# Altium project Krets_Brillz_V2.PrjPcb
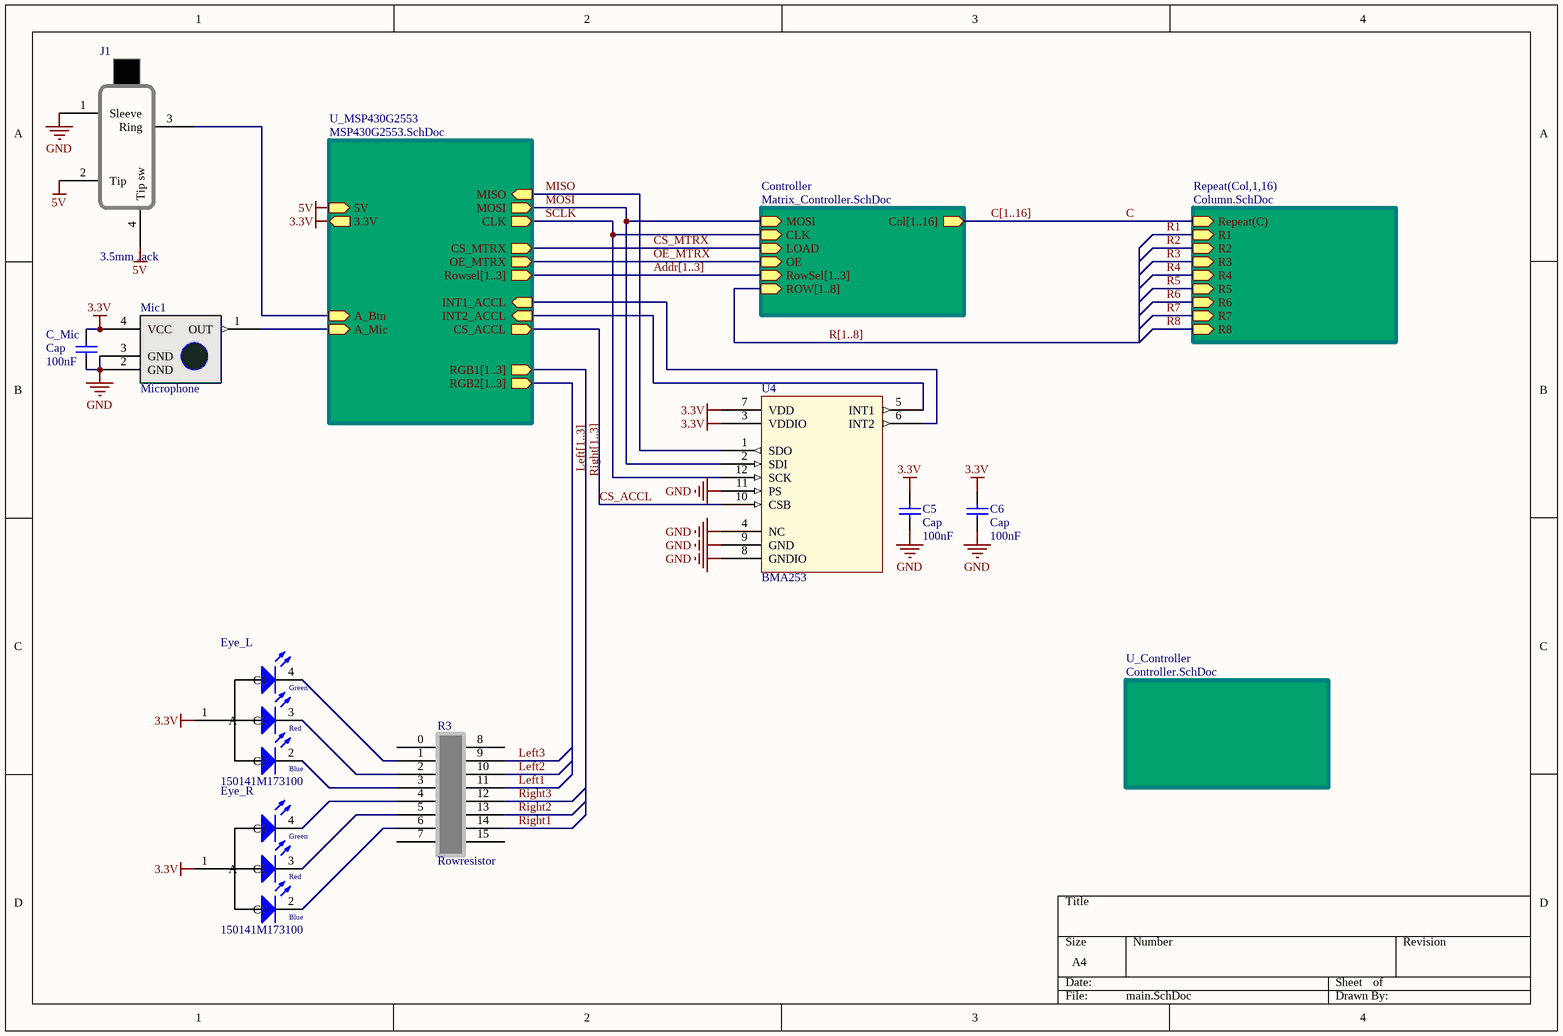
[diagram p0: main.SchDoc]
3 sheets, 145 parts. Net scope: hierarchical (ports join the sheet entries above them; power ports are global).
Board file: SchematicBKP.PcbDoc
Sheets:
  main.SchDoc
    Controller = Matrix_Controller.SchDoc
    Col1 = Column.SchDoc
    Col2 = Column.SchDoc
    Col3 = Column.SchDoc
    Col4 = Column.SchDoc
    Col5 = Column.SchDoc
    Col6 = Column.SchDoc
    Col7 = Column.SchDoc
    Col8 = Column.SchDoc
    Col9 = Column.SchDoc
    Col10 = Column.SchDoc
    Col11 = Column.SchDoc
    Col12 = Column.SchDoc
    Col13 = Column.SchDoc
    Col14 = Column.SchDoc
    Col15 = Column.SchDoc
    Col16 = Column.SchDoc

## Sheet main.SchDoc
size A4

### Parts
C5  Cap  value 100nF  [6-0805_M]
C6  Cap  value 100nF  [6-0805_M]
C_Mic  Cap  value 100nF  [6-0805_M]
Eye_L  150141M173100  [3528_A]
Eye_R  150141M173100  [3528_A]
J1  3.5mm Jack  [Phonejack]
Mic1  Microphone  [SPW2430HR5H-B]
R3  Rowresistor  [Rowres]
U4  BMA253  [BMA253]

### Sub-sheets
Controller = Matrix_Controller.SchDoc: OE (in), LOAD (in), CLK (in), MOSI (in), RowSel[1..3] (in), ROW[1..8] (in), Col[1..16] (out)
Repeat(Col,1,16) = Column.SchDoc: Repeat(C) (in), R1 (in), R2 (in), R3 (in), R4 (in), R5 (in), R6 (in), R7 (in), R8 (in)
U_Controller = Controller.SchDoc (file not in this document): no entries
U_MSP430G2553 = MSP430G2553.SchDoc (file not in this document): 5V (in), 3.3V (out), MOSI (out), MISO (in), CLK (out), CS_MTRX (out), RGB1[1..3] (out), RGB2[1..3] (out), CS_ACCL (out), A_Btn (in), A_Mic (in), Rowsel[1..3] (out), OE_MTRX (out), INT1_ACCL (in), INT2_ACCL (in)

### Nets
3.3V: C5.2 C6.2 C_Mic.1 Eye_L.1(A) Eye_R.1(A) Mic1.4(VCC) U4.3(VDDIO) U4.7(VDD) ; sheet U_MSP430G2553/3.3V
5V: J1.2(Tip) J1.4(Tip_sw) ; sheet U_MSP430G2553/5V
GND: C5.1 C6.1 C_Mic.2 J1.1(Sleeve) Mic1.2(GND) Mic1.3(GND) U4.4(NC) U4.8(GNDIO) U4.9(GND) U4.11(PS)
C: sheet Repeat(Col,1,16)/Repeat(C)
CS_ACCL: U4.10(CSB) ; sheet U_MSP430G2553/CS_ACCL
CS_MTRX: sheet Controller/LOAD, sheet U_MSP430G2553/CS_MTRX
Left1: R3.11
Left2: R3.10
Left3: R3.9
MISO: U4.1(SDO) ; sheet U_MSP430G2553/MISO
MOSI: U4.2(SDI) ; sheet Controller/MOSI, sheet U_MSP430G2553/MOSI
OE_MTRX: sheet Controller/OE, sheet U_MSP430G2553/OE_MTRX
Right1: R3.14
Right2: R3.13
Right3: R3.12
SCLK: U4.12(SCK) ; sheet Controller/CLK, sheet U_MSP430G2553/CLK  [project net CLK]
NetEye_L_2: Eye_L.2(C3) R3.3
NetEye_L_3: Eye_L.3(C2) R3.2
NetEye_L_4: Eye_L.4(C1) R3.1
NetEye_R_2: Eye_R.2(C3) R3.6
NetEye_R_3: Eye_R.3(C2) R3.5
NetEye_R_4: Eye_R.4(C1) R3.4
NetJ1_3: J1.3(Ring) ; sheet U_MSP430G2553/A_Btn
NetMic1_1: Mic1.1(OUT) ; sheet U_MSP430G2553/A_Mic
NetU4_5: U4.5(INT1) ; sheet U_MSP430G2553/INT2_ACCL
NetU4_6: U4.6(INT2) ; sheet U_MSP430G2553/INT1_ACCL

Not connected (* = marked no-connect by the designer): R3 0 7 8 15

### Buses and harness runs
bus Addr[1..3] = sheet Controller/RowSel[1..3] = sheet U_MSP430G2553/Rowsel[1..3]
bus C[1..16] = sheet Controller/Col[1..16]
bus Left[1..3] = sheet U_MSP430G2553/RGB2[1..3]
bus R[1..8] = sheet Controller/ROW[1..8]
bus Right[1..3] = sheet U_MSP430G2553/RGB1[1..3]

### Notes on the sheet
- (in symbol 150141M173100) Green; Red; Blue

### Library data of the parts
C5 C6 C_Mic = Cap: Capacitor; Published: 8-Jun-2000; LatestRevisionDate: 17-Jul-2002; LatestRevisionNote: Re-released for DXP Platform.; PackageReference: RAD-0.3; Publisher: Altium Limited; PackageDescription: Radial Cap, Thru-Hole; 2 Leads; 0.3 in Pin Spacing
Eye_L Eye_R = 150141M173100: SMD Full-Color Top LED, WL-SFTW, Red & Green & Blue; PackageReference: 3528_A; Color: Red & Green & Blue; PartNumber: 150141M173100; ComponentLink1Description: Manufacturer URL; ComponentLink1URL: http://www.we-online.com; ComponentLink2Description: Datasheet; ComponentLink2URL: http://katalog.we-online.com/led/datasheet/150141M173100.pdf
J1 = Phonejack
Mic1 = MIC: SPW2430HR5H-B  MEMs Microphone
R3 = Rowres: Row resistor, 8
U4 = ACCELEROMETER

## Sheet Matrix_Controller.SchDoc
size A4; DocumentName: Matrix controller
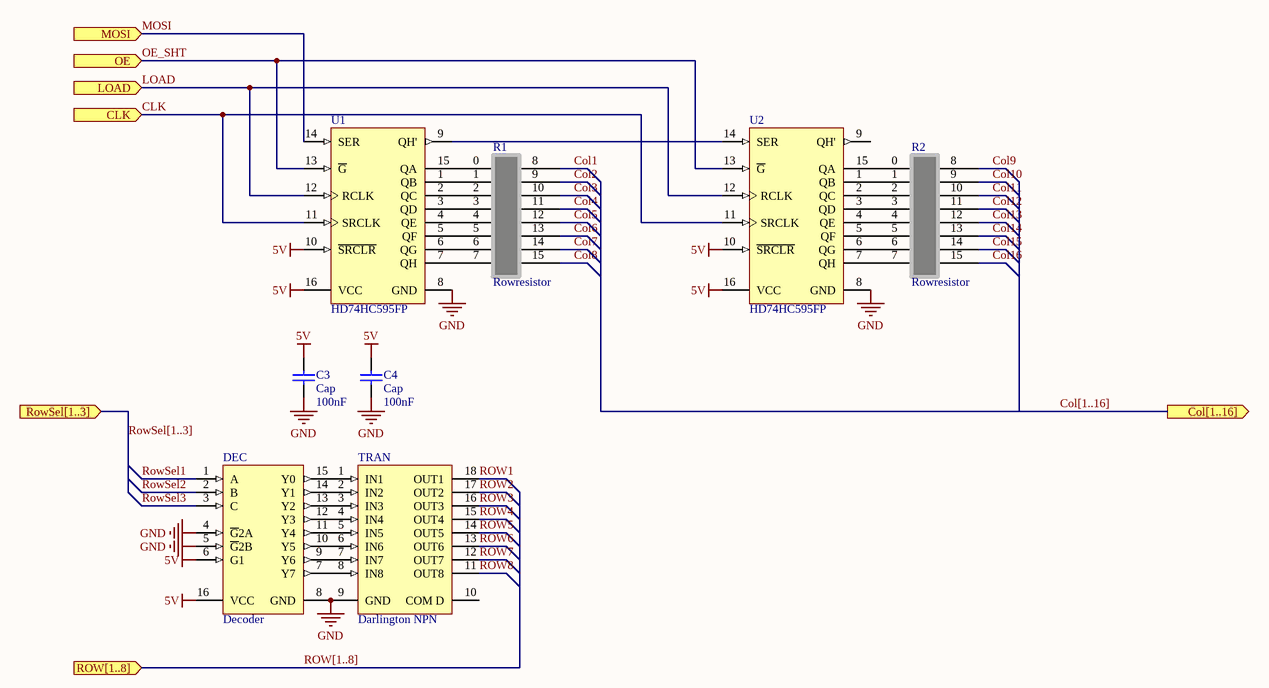
[diagram p1: Matrix_Controller.SchDoc]

### Parts
C3  Cap  value 100nF  [6-0805_M]
C4  Cap  value 100nF  [6-0805_M]
DEC  Decoder  [PRSP0016DH-B_N]
R1  Rowresistor  [Rowres]
R2  Rowresistor  [Rowres]
TRAN  Darlington NPN  [LW18_N]
U1  HD74HC595FP  [PRSP0016DH-B_N]
U2  HD74HC595FP  [PRSP0016DH-B_N]

### Ports
CLK (in), Col[1..16] (out), LOAD (in), MOSI (in), OE (in), ROW[1..8] (in), RowSel[1..3] (in)

### Nets
5V: C3.1 C4.1 DEC.6(G1) DEC.16(VCC) U1.10(~{SRCLR}) U1.16(VCC) U2.10(~{SRCLR}) U2.16(VCC)
GND: C3.2 C4.2 DEC.4(~{G}2A) DEC.5(~{G}2B) DEC.8(GND) TRAN.9(GND) U1.8(GND) U2.8(GND)
CLK: U1.11(SRCLK) U2.11(SRCLK) ; port CLK
Col1: R1.8  [project net C]
Col2: R1.9  [project net C]
Col3: R1.10  [project net C]
Col4: R1.11  [project net C]
Col5: R1.12  [project net C]
Col6: R1.13  [project net C]
Col7: R1.14  [project net C]
Col8: R1.15  [project net C]
Col9: R2.8  [project net C]
Col10: R2.9  [project net C]
Col11: R2.10  [project net C]
Col12: R2.11  [project net C]
Col13: R2.12  [project net C]
Col14: R2.13  [project net C]
Col15: R2.14  [project net C]
Col16: R2.15  [project net C]
LOAD: U1.12(RCLK) U2.12(RCLK) ; port LOAD  [project net CS_MTRX]
MOSI: U1.14(SER) ; port MOSI
OE_SHT: U1.13(~{G}) U2.13(~{G}) ; port OE  [project net OE_MTRX]
ROW1: TRAN.18(OUT1)  [project net R1]
ROW2: TRAN.17(OUT2)  [project net R2]
ROW3: TRAN.16(OUT3)  [project net R3]
ROW4: TRAN.15(OUT4)  [project net R4]
ROW5: TRAN.14(OUT5)  [project net R5]
ROW6: TRAN.13(OUT6)  [project net R6]
ROW7: TRAN.12(OUT7)  [project net R7]
ROW8: TRAN.11(OUT8)  [project net R8]
RowSel1: DEC.1(A)  [project net Addr1]
RowSel2: DEC.2(B)  [project net Addr2]
RowSel3: DEC.3(C)  [project net Addr3]
NetDEC_7: DEC.7(Y7) TRAN.8(IN8)
NetDEC_9: DEC.9(Y6) TRAN.7(IN7)
NetDEC_10: DEC.10(Y5) TRAN.6(IN6)
NetDEC_11: DEC.11(Y4) TRAN.5(IN5)
NetDEC_12: DEC.12(Y3) TRAN.4(IN4)
NetDEC_13: DEC.13(Y2) TRAN.3(IN3)
NetDEC_14: DEC.14(Y1) TRAN.2(IN2)
NetDEC_15: DEC.15(Y0) TRAN.1(IN1)
NetR1_0: R1.0 U1.15(QA)
NetR1_1: R1.1 U1.1(QB)
NetR1_2: R1.2 U1.2(QC)
NetR1_3: R1.3 U1.3(QD)
NetR1_4: R1.4 U1.4(QE)
NetR1_5: R1.5 U1.5(QF)
NetR1_6: R1.6 U1.6(QG)
NetR1_7: R1.7 U1.7(QH)
NetR2_0: R2.0 U2.15(QA)
NetR2_1: R2.1 U2.1(QB)
NetR2_2: R2.2 U2.2(QC)
NetR2_3: R2.3 U2.3(QD)
NetR2_4: R2.4 U2.4(QE)
NetR2_5: R2.5 U2.5(QF)
NetR2_6: R2.6 U2.6(QG)
NetR2_7: R2.7 U2.7(QH)
NetU1_9: U1.9(QH') U2.14(SER)

Not connected (* = marked no-connect by the designer): TRAN 10(COM_D); U2 9(QH')

### Buses and harness runs
bus Col[1..16] = port Col[1..16]
bus ROW[1..8] = port ROW[1..8]
bus RowSel[1..3] = port RowSel[1..3]

### Library data of the parts
C3 C4 = Cap: Capacitor; Published: 8-Jun-2000; LatestRevisionDate: 17-Jul-2002; LatestRevisionNote: Re-released for DXP Platform.; PackageReference: RAD-0.3; Publisher: Altium Limited; PackageDescription: Radial Cap, Thru-Hole; 2 Leads; 0.3 in Pin Spacing
DEC = HD74HC238FP: 3-to-8 Line Decoder / Demultiplexer; Published: 10-Feb-2010; DatasheetVersion: Rev.2.00, Jan-2006; PackageVersion: Sep-2005; PackageReference: PRSP0016DH-B; Publisher: Altium Limited; PackageDescription: 16-Pin Plastic Small Outline Package 1.27 mm Pitch; Code_JEITA: P-SOP16-5.5x10.06-1.27; ComponentLink1Description: Manufacturer Link; ComponentLink1URL: http://sg.renesas.com/fmwk.jsp?cnt=hd74hc_root.jsp&fp=/products/standard_ic/general_purpose_logic/5v_standard_logic/hd74hc/; ComponentLink2Description: Datasheet; ComponentLink2URL: http://documentation.renesas.com/eng/products/logic/rej03d0593_hd74hc238ds.pdf; ComponentLink3Description: Packaging Specification; ComponentLink3URL: http://sg.renesas.com/media/products/common_info/package/pdf/ic/code/prsp0016dh_b.pdf
R1 R2 = Rowres: Row resistor, 8
TRAN = ULN2803LW: High-Voltage, High-Current Darlington Array; Published: 13-Oct-2000; LatestRevisionDate: 13-Apr-2006; LatestRevisionNote: IPC-7351 Footprint Added.; DatasheetVersion: 1999; PackageReference: LW18; Publisher: Altium Limited; PackageDescription: 18-Pin Small Outline Integrated Circuit 1.27 mm Pitch; Code_JEDEC: MS-013-AB; ComponentLink1Description: Manufacturer Link; ComponentLink1URL: http://www.allegromicro.com/
U1 U2 = HD74HC595FP: 8-bit Shift Register / Latch with 3-State Outputs; Published: 10-Feb-2010; DatasheetVersion: Rev.2.00, Mar-2006; PackageVersion: Sep-2005; PackageReference: PRSP0016DH-B; Publisher: Altium Limited; PackageDescription: 16-Pin Plastic Small Outline Package 1.27 mm Pitch; Code_JEITA: P-SOP16-5.5x10.06-1.27; ComponentLink1Description: Manufacturer Link; ComponentLink1URL: http://sg.renesas.com/fmwk.jsp?cnt=hd74hc_root.jsp&fp=/products/standard_ic/general_purpose_logic/5v_standard_logic/hd74hc/; ComponentLink2Description: Datasheet; ComponentLink2URL: http://documentation.renesas.com/eng/products/logic/rej03d0634_hd74hc595ds.pdf; ComponentLink3Description: Packaging Specification; ComponentLink3URL: http://sg.renesas.com/media/products/common_info/package/pdf/ic/code/prsp0016dh_b.pdf

## Sheet Column.SchDoc
size A4
Used 16 times, as channels Col1, Col2, Col3, Col4, Col5, Col6, Col7, Col8, Col9, Col10, Col11, Col12, Col13, Col14, Col15, Col16. Parts and nets are listed once, with the designators drawn on the sheet.
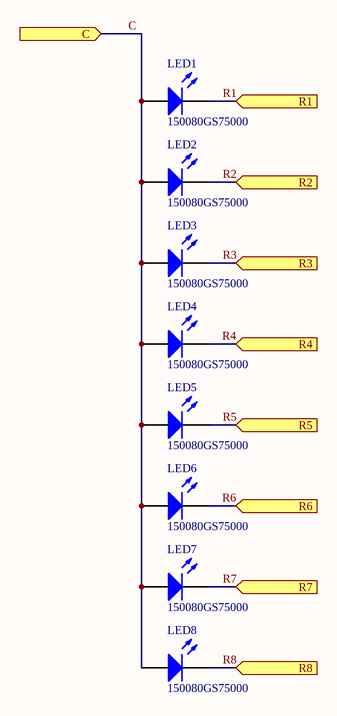
[diagram p2: Column.SchDoc]

### Parts
LED1  150080GS75000  [0805_A]
LED2  150080GS75000  [0805_A]
LED3  150080GS75000  [0805_A]
LED4  150080GS75000  [0805_A]
LED5  150080GS75000  [0805_A]
LED6  150080GS75000  [0805_A]
LED7  150080GS75000  [0805_A]
LED8  150080GS75000  [0805_A]

### Ports
C (in), R1 (in), R2 (in), R3 (in), R4 (in), R5 (in), R6 (in), R7 (in), R8 (in)

### Nets
C: LED1.2(A) LED2.2(A) LED3.2(A) LED4.2(A) LED5.2(A) LED6.2(A) LED7.2(A) LED8.2(A) ; port C
R1: LED1.1(K) ; port R1
R2: LED2.1(K) ; port R2
R3: LED3.1(K) ; port R3
R4: LED4.1(K) ; port R4
R5: LED5.1(K) ; port R5
R6: LED6.1(K) ; port R6
R7: LED7.1(K) ; port R7
R8: LED8.1(K) ; port R8

### Channels
Col1: designators end in _Col1; ports C=C R1=R1 R2=R2 R3=R3 R4=R4 R5=R5 R6=R6 R7=R7 R8=R8
Col2: designators end in _Col2; ports C=C R1=R1 R2=R2 R3=R3 R4=R4 R5=R5 R6=R6 R7=R7 R8=R8
Col3: designators end in _Col3; ports C=C R1=R1 R2=R2 R3=R3 R4=R4 R5=R5 R6=R6 R7=R7 R8=R8
Col4: designators end in _Col4; ports C=C R1=R1 R2=R2 R3=R3 R4=R4 R5=R5 R6=R6 R7=R7 R8=R8
Col5: designators end in _Col5; ports C=C R1=R1 R2=R2 R3=R3 R4=R4 R5=R5 R6=R6 R7=R7 R8=R8
Col6: designators end in _Col6; ports C=C R1=R1 R2=R2 R3=R3 R4=R4 R5=R5 R6=R6 R7=R7 R8=R8
Col7: designators end in _Col7; ports C=C R1=R1 R2=R2 R3=R3 R4=R4 R5=R5 R6=R6 R7=R7 R8=R8
Col8: designators end in _Col8; ports C=C R1=R1 R2=R2 R3=R3 R4=R4 R5=R5 R6=R6 R7=R7 R8=R8
Col9: designators end in _Col9; ports C=C R1=R1 R2=R2 R3=R3 R4=R4 R5=R5 R6=R6 R7=R7 R8=R8
Col10: designators end in _Col10; ports C=C R1=R1 R2=R2 R3=R3 R4=R4 R5=R5 R6=R6 R7=R7 R8=R8
Col11: designators end in _Col11; ports C=C R1=R1 R2=R2 R3=R3 R4=R4 R5=R5 R6=R6 R7=R7 R8=R8
Col12: designators end in _Col12; ports C=C R1=R1 R2=R2 R3=R3 R4=R4 R5=R5 R6=R6 R7=R7 R8=R8
Col13: designators end in _Col13; ports C=C R1=R1 R2=R2 R3=R3 R4=R4 R5=R5 R6=R6 R7=R7 R8=R8
Col14: designators end in _Col14; ports C=C R1=R1 R2=R2 R3=R3 R4=R4 R5=R5 R6=R6 R7=R7 R8=R8
Col15: designators end in _Col15; ports C=C R1=R1 R2=R2 R3=R3 R4=R4 R5=R5 R6=R6 R7=R7 R8=R8
Col16: designators end in _Col16; ports C=C R1=R1 R2=R2 R3=R3 R4=R4 R5=R5 R6=R6 R7=R7 R8=R8

### Library data of the parts
LED1-LED8 = 150080GS75000: SMD mono-color Chip LED, WL-SMCW, Green; PackageReference: 0805_A; Color: Green; PartNumber: 150080GS75000; ComponentLink1Description: Manufacturer URL; ComponentLink1URL: http://www.we-online.com; ComponentLink2Description: Datasheet; ComponentLink2URL: http://katalog.we-online.com/led/datasheet/150080GS75000.pdf

## Nets that join several sheets
5V: main (J1.2 J1.4), Matrix_Controller (8 pins)
GND: main (10 pins), Matrix_Controller (8 pins)
C: Matrix_Controller (R1.8), Col1 (8 pins)
C: Matrix_Controller (R1.9), Col2 (8 pins)
C: Matrix_Controller (R1.10), Col3 (8 pins)
C: Matrix_Controller (R1.11), Col4 (8 pins)
C: Matrix_Controller (R1.12), Col5 (8 pins)
C: Matrix_Controller (R1.13), Col6 (8 pins)
C: Matrix_Controller (R1.14), Col7 (8 pins)
C: Matrix_Controller (R1.15), Col8 (8 pins)
C: Matrix_Controller (R2.8), Col9 (8 pins)
C: Matrix_Controller (R2.9), Col10 (8 pins)
C: Matrix_Controller (R2.10), Col11 (8 pins)
C: Matrix_Controller (R2.11), Col12 (8 pins)
C: Matrix_Controller (R2.12), Col13 (8 pins)
C: Matrix_Controller (R2.13), Col14 (8 pins)
C: Matrix_Controller (R2.14), Col15 (8 pins)
C: Matrix_Controller (R2.15), Col16 (8 pins)
CLK: main (U4.12), Matrix_Controller (U1.11 U2.11)
MOSI: main (U4.2), Matrix_Controller (U1.14)
R1: Matrix_Controller (TRAN.18), Col1 (LED1_Col1.1), Col2 (LED1_Col2.1), Col3 (LED1_Col3.1), Col4 (LED1_Col4.1), Col5 (LED1_Col5.1), Col6 (LED1_Col6.1), Col7 (LED1_Col7.1), Col8 (LED1_Col8.1), Col9 (LED1_Col9.1), Col10 (LED1_Col10.1), Col11 (LED1_Col11.1), Col12 (LED1_Col12.1), Col13 (LED1_Col13.1), Col14 (LED1_Col14.1), Col15 (LED1_Col15.1), Col16 (LED1_Col16.1)
R2: Matrix_Controller (TRAN.17), Col1 (LED2_Col1.1), Col2 (LED2_Col2.1), Col3 (LED2_Col3.1), Col4 (LED2_Col4.1), Col5 (LED2_Col5.1), Col6 (LED2_Col6.1), Col7 (LED2_Col7.1), Col8 (LED2_Col8.1), Col9 (LED2_Col9.1), Col10 (LED2_Col10.1), Col11 (LED2_Col11.1), Col12 (LED2_Col12.1), Col13 (LED2_Col13.1), Col14 (LED2_Col14.1), Col15 (LED2_Col15.1), Col16 (LED2_Col16.1)
R3: Matrix_Controller (TRAN.16), Col1 (LED3_Col1.1), Col2 (LED3_Col2.1), Col3 (LED3_Col3.1), Col4 (LED3_Col4.1), Col5 (LED3_Col5.1), Col6 (LED3_Col6.1), Col7 (LED3_Col7.1), Col8 (LED3_Col8.1), Col9 (LED3_Col9.1), Col10 (LED3_Col10.1), Col11 (LED3_Col11.1), Col12 (LED3_Col12.1), Col13 (LED3_Col13.1), Col14 (LED3_Col14.1), Col15 (LED3_Col15.1), Col16 (LED3_Col16.1)
R4: Matrix_Controller (TRAN.15), Col1 (LED4_Col1.1), Col2 (LED4_Col2.1), Col3 (LED4_Col3.1), Col4 (LED4_Col4.1), Col5 (LED4_Col5.1), Col6 (LED4_Col6.1), Col7 (LED4_Col7.1), Col8 (LED4_Col8.1), Col9 (LED4_Col9.1), Col10 (LED4_Col10.1), Col11 (LED4_Col11.1), Col12 (LED4_Col12.1), Col13 (LED4_Col13.1), Col14 (LED4_Col14.1), Col15 (LED4_Col15.1), Col16 (LED4_Col16.1)
R5: Matrix_Controller (TRAN.14), Col1 (LED5_Col1.1), Col2 (LED5_Col2.1), Col3 (LED5_Col3.1), Col4 (LED5_Col4.1), Col5 (LED5_Col5.1), Col6 (LED5_Col6.1), Col7 (LED5_Col7.1), Col8 (LED5_Col8.1), Col9 (LED5_Col9.1), Col10 (LED5_Col10.1), Col11 (LED5_Col11.1), Col12 (LED5_Col12.1), Col13 (LED5_Col13.1), Col14 (LED5_Col14.1), Col15 (LED5_Col15.1), Col16 (LED5_Col16.1)
R6: Matrix_Controller (TRAN.13), Col1 (LED6_Col1.1), Col2 (LED6_Col2.1), Col3 (LED6_Col3.1), Col4 (LED6_Col4.1), Col5 (LED6_Col5.1), Col6 (LED6_Col6.1), Col7 (LED6_Col7.1), Col8 (LED6_Col8.1), Col9 (LED6_Col9.1), Col10 (LED6_Col10.1), Col11 (LED6_Col11.1), Col12 (LED6_Col12.1), Col13 (LED6_Col13.1), Col14 (LED6_Col14.1), Col15 (LED6_Col15.1), Col16 (LED6_Col16.1)
R7: Matrix_Controller (TRAN.12), Col1 (LED7_Col1.1), Col2 (LED7_Col2.1), Col3 (LED7_Col3.1), Col4 (LED7_Col4.1), Col5 (LED7_Col5.1), Col6 (LED7_Col6.1), Col7 (LED7_Col7.1), Col8 (LED7_Col8.1), Col9 (LED7_Col9.1), Col10 (LED7_Col10.1), Col11 (LED7_Col11.1), Col12 (LED7_Col12.1), Col13 (LED7_Col13.1), Col14 (LED7_Col14.1), Col15 (LED7_Col15.1), Col16 (LED7_Col16.1)
R8: Matrix_Controller (TRAN.11), Col1 (LED8_Col1.1), Col2 (LED8_Col2.1), Col3 (LED8_Col3.1), Col4 (LED8_Col4.1), Col5 (LED8_Col5.1), Col6 (LED8_Col6.1), Col7 (LED8_Col7.1), Col8 (LED8_Col8.1), Col9 (LED8_Col9.1), Col10 (LED8_Col10.1), Col11 (LED8_Col11.1), Col12 (LED8_Col12.1), Col13 (LED8_Col13.1), Col14 (LED8_Col14.1), Col15 (LED8_Col15.1), Col16 (LED8_Col16.1)